# Altium schematic sheet LTC6820.SchDoc
size A4
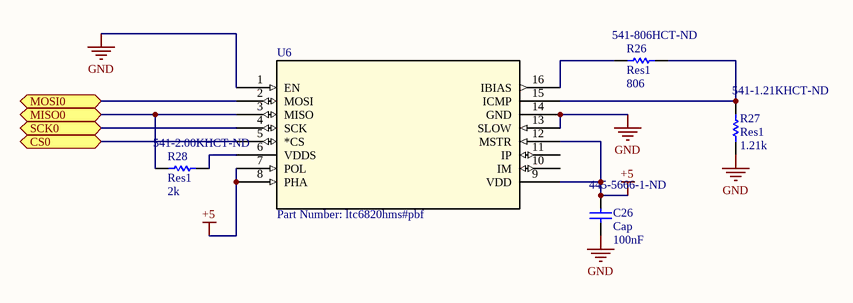
[diagram p0: LTC6820.SchDoc]

## Parts
C26  Cap  value 100nF  Supplier Part Number 1: 445-5666-1-ND  [J1-0603]
R26  Res1  value 806  Supplier Part Number 1: 541-806HCT-ND  [J1-0603]
R27  Res1  value 1.21k  Supplier Part Number 1: 541-1.21KHCT-ND  [J1-0603]
R28  Res1  value 2k  Supplier Part Number 1: 541-2.00KHCT-ND  [J1-0603]
U6  Part Number: ltc6820hms#pbf  [MSOP-16_MS]

## Ports
CS0 (bidir), MISO0 (bidir), MOSI0 (bidir), SCK0 (bidir)

## Nets
+5: C26.2 U6.7(POL) U6.8(PHA) U6.9(VDD) U6.12(MSTR)
GND: C26.1 R27.1 U6.1(EN) U6.13(SLOW) U6.14(GND)
CS0: U6.5(*CS) ; port CS0
MISO0: R28.1 U6.3(MISO) ; port MISO0
MOSI0: U6.2(MOSI) ; port MOSI0
SCK0: U6.4(SCK) ; port SCK0
NetR26_1: R26.1 U6.16(IBIAS)
NetR26_2: R26.2 R27.2 U6.15(ICMP)
NetR28_2: R28.2 U6.6(VDDS)

Not connected (* = marked no-connect by the designer): U6 10(IM) 11(IP)

## Library data of the parts
C26 = Cap: TDK - CGA3E2X7R1H104K080AA. - CERAMIC CAPACITOR, 0.1UF, 50V, X7R, 0603, FULL REEL; Tolerance: 10%; Published: 8-Jun-2000; LatestRevisionDate: 17-Jul-2002; LatestRevisionNote: Re-released for DXP Platform.; PackageReference: RAD-0.3; Publisher: Altium Limited; PackageDescription: Radial Cap, Thru-Hole; 2 Leads; 0.3 in Pin Spacing; Supplier 1: Digi-Key; Manufacturer: TDK; Manufacturer Part Number: CGA3E2X7R1H104K080AA; RoHS: Yes; Category: Ceramic Capacitors; Stock 1: 7293536; Pricing 1: 1=0.10000, 10=0.07600, 50=0.04160, 100=0.03400, 500=0.02426, 1000=0.01906 (USD); Mount: Surface Mount; Case/Package: 0603; Weight: 7.1E-05oz; Case Code (Imperial): 0603; Case Code (Metric): 1608; Min Operating Temperature: -55°C; Max Operating Temperature: 125°C; Capacitance: 100nF; Packaging: Tape and Reel; Package Quantity: 1; Voltage Rating: 50V; Dielectric: X7R; Voltage Rating (DC): 50V; Termination: SMD/SMT; Voltage: 50V; Composition: Ceramic; Length: 1.6mm; Height: 0.8mm; Width: 0.8mm; Depth: 0.8mm; Thickness: 0.035inch; Ratings: AEC-Q200; Radiation Hardening: No; REACH SVHC: No SVHC; Lead Free: Lead Free; ComponentLink1URL: https://datasheet.ciiva.com/24216/cga3e2x7r1h104k080aa-266291-24216208.pdf?src-supplier=Mouser; ComponentLink1Description: https://datasheet.ciiva.com/24216/cga3e2x7r1h104k080aa-266291-24216208.pdf?src-supplier=Mouser; ComponentLink2URL: https://datasheet.ciiva.com/15192/getdatasheetpartid-715867-15192412.pdf?src-supplier=Verical; ComponentLink2Description: https://datasheet.ciiva.com/15192/getdatasheetpartid-715867-15192412.pdf?src-supplier=Verical; ComponentLink3URL: https://datasheet.ciiva.com/16500/mlccspec-automotive-general-midvoltage-en-16500693.pdf?src-supplier=Future+Electronics; ComponentLink3Description: https://datasheet.ciiva.com/16500/mlccspec-automotive-general-midvoltage-en-16500693.pdf?src-supplier=Future+Electronics; ComponentLink4URL: https://datasheet.ciiva.com/22725/1735392-22725642.pdf?src-supplier=Element14; ComponentLink4Description: https://datasheet.ciiva.com/22725/1735392-22725642.pdf?src-supplier=Element14; ComponentLink5URL: https://datasheet.ciiva.com/23803/1936565-23803084.pdf?src-supplier=Newark; ComponentLink5Description: https://datasheet.ciiva.com/23803/1936565-23803084.pdf?src-supplier=Newark; ComponentLink6URL: https://datasheet.ciiva.com/46385/1735392-46385708.pdf?src-supplier=Element14; ComponentLink6Description: https://datasheet.ciiva.com/46385/1735392-46385708.pdf?src-supplier=Element14
R26 = Res1: RES SMD 806 OHM 1% 1/10W 0603; Manufacturer: Vishay; Manufacturer Part Number: CRCW0603806RFKEA; Resistance: 806R; Temperature Coefficient: 100ppm/°C; Power Rating: 100mW; Voltage Rating: 75V; Published: 8-Jun-2000; LatestRevisionDate: 17-Jul-2002; LatestRevisionNote: Re-released for DXP Platform.; PackageReference: AXIAL-0.3; Publisher: Altium Limited; PackageDescription: Axial Device, Thru-Hole; 2 Leads; 0.3 in Pin Spacing; Supplier 1: Digi-Key; RoHS: Yes; Category: Chip SMD Resistors; Stock 1: 15321; Pricing 1: 1=0.10000, 10=0.03300, 100=0.01340, 1000=0.00602, 2500=0.00522 (USD); Mount: Surface Mount; Case/Package: 0603; Weight: 7.1E-05oz; Case Code (Metric): 1608; Case Code (Imperial): 0603; Contact Plating: Tin; Min Operating Temperature: -55°C; Max Operating Temperature: 155°C; Packaging: Tape and Reel; Tolerance: 1%; Package Quantity: 10; Termination: SMD/SMT; Composition: Thick Film; Number of Terminations: 2; Max Power Dissipation: 100mW; Military Standard: Not; Features: Automotive AEC-Q200; Working Voltage: 75V; Length: 1.55mm; Height: 0.45mm; Width: 0.033inch; Depth: 0.85mm; Radiation Hardening: No; REACH SVHC: Unknown; ComponentLink1URL: https://datasheet.ciiva.com/11809/0900766b80d98afc-11809816.pdf?src-supplier=RSComponents; ComponentLink1Description: https://datasheet.ciiva.com/11809/0900766b80d98afc-11809816.pdf?src-supplier=RSComponents; ComponentLink2URL: https://datasheet.ciiva.com/2466/dcrcwe3-2466496.pdf?src-supplier=Digi-Key; ComponentLink2Description: https://datasheet.ciiva.com/2466/dcrcwe3-2466496.pdf?src-supplier=Digi-Key; ComponentLink3URL: https://datasheet.ciiva.com/15159/getdatasheetpartid-32773-15159334.pdf?src-supplier=Verical; ComponentLink3Description: https://datasheet.ciiva.com/15159/getdatasheetpartid-32773-15159334.pdf?src-supplier=Verical; ComponentLink4URL: https://datasheet.ciiva.com/7672/1697337-7672567.pdf?src-supplier=Element14; ComponentLink4Description: https://datasheet.ciiva.com/7672/1697337-7672567.pdf?src-supplier=Element14; ComponentLink5URL: https://datasheet.ciiva.com/16199/dcrcwe3-16199879.pdf?src-supplier=Future+Electronics; ComponentLink5Description: https://datasheet.ciiva.com/16199/dcrcwe3-16199879.pdf?src-supplier=Future+Electronics; ComponentLink6URL: https://datasheet.ciiva.com/3257/dcrcwe3-3257912.pdf?src-supplier=Avnet; ComponentLink6Description: https://datasheet.ciiva.com/3257/dcrcwe3-3257912.pdf?src-supplier=Avnet; ComponentLink7URL: https://datasheet.ciiva.com/7672/1697337-7672568.pdf?src-supplier=Element14; ComponentLink7Description: https://datasheet.ciiva.com/7672/1697337-7672568.pdf?src-supplier=Element14; ComponentLink8URL: https://datasheet.ciiva.com/3257/dcrcwe3-3257913.pdf?src-supplier=Avnet; ComponentLink8Description: https://datasheet.ciiva.com/3257/dcrcwe3-3257913.pdf?src-supplier=Avnet; ComponentLink9URL: https://datasheet.ciiva.com/16782/70201119-16782811.pdf?src-supplier=Allied+Electronics; ComponentLink9Description: https://datasheet.ciiva.com/16782/70201119-16782811.pdf?src-supplier=Allied+Electronics; ComponentLink10URL: https://datasheet.ciiva.com/16884/dcrcwe3-16884269.pdf?src-supplier=Avnet+Europe; ComponentLink10Description: https://datasheet.ciiva.com/16884/dcrcwe3-16884269.pdf?src-supplier=Avnet+Europe; ComponentLink11URL: https://datasheet.ciiva.com/2466/dcrcwe3-2466494.pdf?src-supplier=Digi-Key; ComponentLink11Description: https://datasheet.ciiva.com/2466/dcrcwe3-2466494.pdf?src-supplier=Digi-Key; ComponentLink12URL: https://datasheet.ciiva.com/5546/dcrcwe3-109170-5546782.pdf?src-supplier=Mouser; ComponentLink12Description: https://datasheet.ciiva.com/5546/dcrcwe3-109170-5546782.pdf?src-supplier=Mouser; ComponentLink13URL: https://datasheet.ciiva.com/2466/dcrcwe3-2466495.pdf?src-supplier=Digi-Key; ComponentLink13Description: https://datasheet.ciiva.com/2466/dcrcwe3-2466495.pdf?src-supplier=Digi-Key
R27 = Res1: Res Thick Film 0603 1.21K Ohm 1% 1/10W 100ppm/C Molded SMD Paper T/R; Manufacturer: Vishay; Manufacturer Part Number: CRCW06031K21FKEA; Power Rating: 100mW; Resistance: 1.21kR; Temperature Coefficient: 100ppm/°C; Voltage Rating: 75V; Published: 8-Jun-2000; LatestRevisionDate: 17-Jul-2002; LatestRevisionNote: Re-released for DXP Platform.; PackageReference: AXIAL-0.3; Publisher: Altium Limited; PackageDescription: Axial Device, Thru-Hole; 2 Leads; 0.3 in Pin Spacing; Supplier 1: Digi-Key; RoHS: Yes; Category: Chip SMD Resistors; Stock 1: 10304; Pricing 1: 1=0.10000, 10=0.03300, 100=0.01340, 1000=0.00602, 2500=0.00522 (USD); Mount: Surface Mount; Case/Package: 0603; Weight: 7.1E-05oz; Case Code (Metric): 1608; Case Code (Imperial): 0603; Contact Plating: Tin; Min Operating Temperature: -55°C; Max Operating Temperature: 155°C; Tolerance: 1%; Packaging: Tape and Reel; Composition: Thick Film; Voltage Rating (DC): 75V; Package Quantity: 10; Number of Terminations: 2; Military Standard: Not; Max Power Dissipation: 100mW; Termination: SMD/SMT; Features: Automotive AEC-Q200; Length: 1.55mm; Height: 0.45mm; Width: 0.033inch; Depth: 0.85mm; Radiation Hardening: No; REACH SVHC: Unknown; Lead Free: Lead Free; ComponentLink1URL: https://datasheet.ciiva.com/11811/0900766b80d98afc-11811488.pdf?src-supplier=RSComponents; ComponentLink1Description: https://datasheet.ciiva.com/11811/0900766b80d98afc-11811488.pdf?src-supplier=RSComponents; ComponentLink2URL: https://datasheet.ciiva.com/2466/dcrcwe3-2466209.pdf?src-supplier=Digi-Key; ComponentLink2Description: https://datasheet.ciiva.com/2466/dcrcwe3-2466209.pdf?src-supplier=Digi-Key; ComponentLink3URL: https://datasheet.ciiva.com/2466/dcrcwe3-2466210.pdf?src-supplier=Digi-Key; ComponentLink3Description: https://datasheet.ciiva.com/2466/dcrcwe3-2466210.pdf?src-supplier=Digi-Key; ComponentLink4URL: https://datasheet.ciiva.com/2466/dcrcwe3-2466211.pdf?src-supplier=Digi-Key; ComponentLink4Description: https://datasheet.ciiva.com/2466/dcrcwe3-2466211.pdf?src-supplier=Digi-Key; ComponentLink5URL: https://datasheet.ciiva.com/3257/dcrcwe3-3257157.pdf?src-supplier=Avnet; ComponentLink5Description: https://datasheet.ciiva.com/3257/dcrcwe3-3257157.pdf?src-supplier=Avnet; ComponentLink6URL: https://datasheet.ciiva.com/7690/1533075-7690856.pdf?src-supplier=Element14; ComponentLink6Description: https://datasheet.ciiva.com/7690/1533075-7690856.pdf?src-supplier=Element14; ComponentLink7URL: https://datasheet.ciiva.com/16213/dcrcwe3-16213112.pdf?src-supplier=Future+Electronics; ComponentLink7Description: https://datasheet.ciiva.com/16213/dcrcwe3-16213112.pdf?src-supplier=Future+Electronics; ComponentLink8URL: https://datasheet.ciiva.com/5541/dcrcwe3-109170-5541610.pdf?src-supplier=Mouser; ComponentLink8Description: https://datasheet.ciiva.com/5541/dcrcwe3-109170-5541610.pdf?src-supplier=Mouser; ComponentLink9URL: https://datasheet.ciiva.com/16764/70201119-16764972.pdf?src-supplier=Allied+Electronics; ComponentLink9Description: https://datasheet.ciiva.com/16764/70201119-16764972.pdf?src-supplier=Allied+Electronics
R28 = Res1: D11/CRCW0603 100 2K 1% ET1 e3; Manufacturer: Vishay; Manufacturer Part Number: CRCW06032K00FKEA; Resistance: 2kR; Temperature Coefficient: 100ppm/°C; Power Rating: 100mW; Voltage Rating: 75V; Published: 8-Jun-2000; LatestRevisionDate: 17-Jul-2002; LatestRevisionNote: Re-released for DXP Platform.; PackageReference: AXIAL-0.3; Publisher: Altium Limited; PackageDescription: Axial Device, Thru-Hole; 2 Leads; 0.3 in Pin Spacing; Supplier 1: Digi-Key; RoHS: Yes; Category: Chip SMD Resistors; Stock 1: 2299; Pricing 1: 1=0.10000, 10=0.03300, 100=0.01340, 1000=0.00602, 2500=0.00522 (USD); Mount: Surface Mount; Case/Package: 0603; Number of Pins: 2; Weight: 7.1E-05oz; Case Code (Imperial): 0603; Case Code (Metric): 1608; Contact Plating: Tin,Lead; Min Operating Temperature: -55°C; Max Operating Temperature: 155°C; Packaging: Tape and Reel; Composition: Thick Film; Tolerance: 1%; Termination: Solder; Package Quantity: 10; Number of Terminations: 2; Voltage Rating (DC): 75V; Max Power Dissipation: 100mW; Military Standard: Not; Features: Automotive AEC-Q200; Length: 1.55mm; Height: 0.45mm; Width: 0.85mm; Depth: 0.85mm; Radiation Hardening: No; Lead Free: Lead Free; REACH SVHC: Unknown; ComponentLink1URL: https://datasheet.ciiva.com/7673/1720486-7673525.pdf?src-supplier=Element14; ComponentLink1Description: https://datasheet.ciiva.com/7673/1720486-7673525.pdf?src-supplier=Element14; ComponentLink2URL: https://datasheet.ciiva.com/28621/125364-28621397.pdf?src-supplier=Element14; ComponentLink2Description: https://datasheet.ciiva.com/28621/125364-28621397.pdf?src-supplier=Element14; ComponentLink3URL: https://datasheet.ciiva.com/16882/dcrcw-16882855.pdf?src-supplier=Avnet+Europe; ComponentLink3Description: https://datasheet.ciiva.com/16882/dcrcw-16882855.pdf?src-supplier=Avnet+Europe; ComponentLink4URL: https://datasheet.ciiva.com/3257/dcrcwe3-3257366.pdf?src-supplier=Avnet; ComponentLink4Description: https://datasheet.ciiva.com/3257/dcrcwe3-3257366.pdf?src-supplier=Avnet; ComponentLink5URL: https://datasheet.ciiva.com/3257/dcrcwe3-3257367.pdf?src-supplier=Avnet; ComponentLink5Description: https://datasheet.ciiva.com/3257/dcrcwe3-3257367.pdf?src-supplier=Avnet; ComponentLink6URL: https://datasheet.ciiva.com/5551/dcrcwe3-109170-5551994.pdf?src-supplier=Mouser; ComponentLink6Description: https://datasheet.ciiva.com/5551/dcrcwe3-109170-5551994.pdf?src-supplier=Mouser; ComponentLink7URL: https://datasheet.ciiva.com/16755/70201119-16755770.pdf?src-supplier=Allied+Electronics; ComponentLink7Description: https://datasheet.ciiva.com/16755/70201119-16755770.pdf?src-supplier=Allied+Electronics; ComponentLink8URL: https://datasheet.ciiva.com/26314/fld-crcw-e3-data-en-26314682.pdf?src-supplier=Distrelec; ComponentLink8Description: https://datasheet.ciiva.com/26314/fld-crcw-e3-data-en-26314682.pdf?src-supplier=Distrelec; ComponentLink9URL: https://datasheet.ciiva.com/2465/dcrcwe3-2465564.pdf?src-supplier=Digi-Key; ComponentLink9Description: https://datasheet.ciiva.com/2465/dcrcwe3-2465564.pdf?src-supplier=Digi-Key; ComponentLink10URL: https://datasheet.ciiva.com/16765/70201119-16765388.pdf?src-supplier=Allied+Electronics; ComponentLink10Description: https://datasheet.ciiva.com/16765/70201119-16765388.pdf?src-supplier=Allied+Electronics; ComponentLink11URL: https://datasheet.ciiva.com/2465/dcrcwe3-2465565.pdf?src-supplier=Digi-Key; ComponentLink11Description: https://datasheet.ciiva.com/2465/dcrcwe3-2465565.pdf?src-supplier=Digi-Key; ComponentLink12URL: https://datasheet.ciiva.com/2465/dcrcwe3-2465566.pdf?src-supplier=Digi-Key; ComponentLink12Description: https://datasheet.ciiva.com/2465/dcrcwe3-2465566.pdf?src-supplier=Digi-Key
U6 = LTC6820HMSPBF: No Description Available; Vendor: Linear Technology; Manufacturer_Part_Number: ltc6820hms#pbf; Copyright: Copyright (C) 2018 Accelerated Designs. All rights reserved; RefDes: RefDes; Type: DEV; Value: Value